# EAGLE design mainboard_transmitter.vf0.1 (EAGLE 7.1.0)
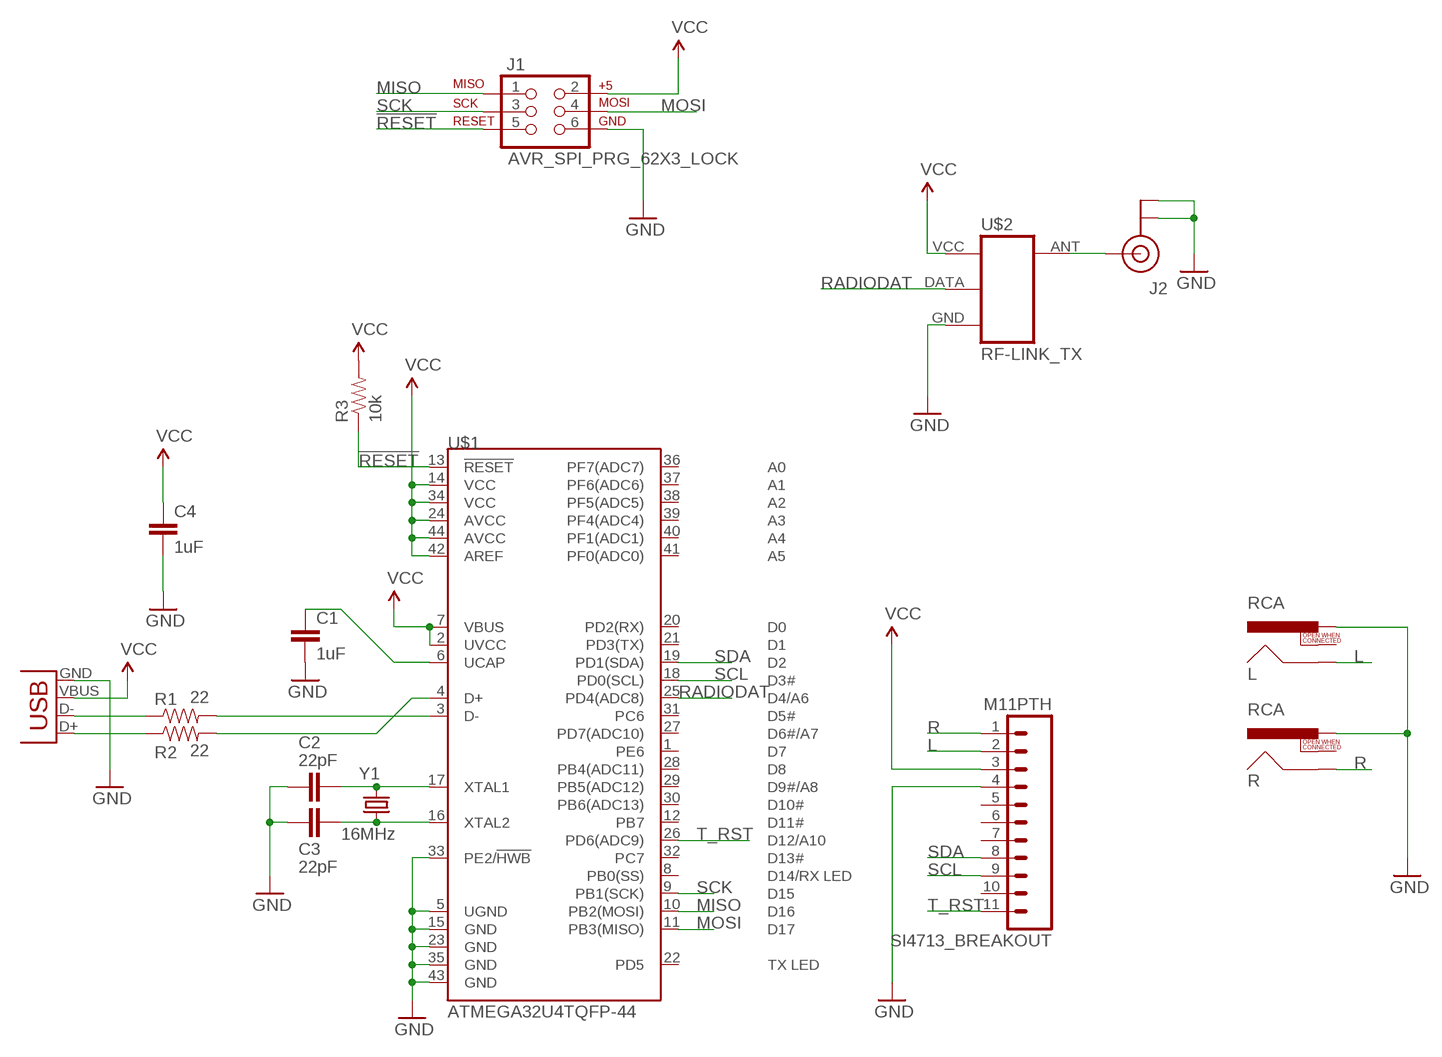
[diagram p0: schematic, sheet 1]

## Parts
C1  1uF  CAPPTH  [CAP-PTH-SMALL]
C2  22pF  CAPPTH  [CAP-PTH-SMALL]
C3  22pF  CAPPTH  [CAP-PTH-SMALL]
C4  1uF  CAPPTH  [CAP-PTH-SMALL]
J1  AVR_SPI_PRG_62X3_LOCK  [2X3_LOCK]
J2  U.FL  [U.FL]
JP1  USB-B  USBPTH  [USB-B-PTH]
L  RCA  [RCA]
R  RCA  [RCA]
R1  22  RESISTORPTH-1/4W-VERT  [AXIAL-0.1]
R2  22  RESISTORPTH-1/4W-VERT  [AXIAL-0.1]
R3  10k  10KOHM-1/4W5%(PTH)VERT  [AXIAL-0.1]
SI4713_BREAKOUT  M11PTH  [1X11]
U$1  ATMEGA32U4TQFP-44  [TQFP44]
U$2  RF-LINK_TX  [RF-LINK_TX]
Y1  16MHz  CRYSTALHC49US  [HC49US]

## Nets
!RESET: J1.5 R3.P$1 U$1.13(!RESET)
GND: C1.2 C2.1 C3.1 C4.2 J1.6 J2.P$1(GND) J2.P$2(GND) JP1.GND L.PIN R.PIN SI4713_BREAKOUT.4 U$1.5(UGND) U$1.15(GND) U$1.23(GND) U$1.33(PE2/!HWB) U$1.35(GND) U$1.43(GND) U$2.GND
L: L.SHELL SI4713_BREAKOUT.2
MISO: J1.1 U$1.10(PB2(MOSI))
MOSI: J1.4 U$1.11(PB3(MISO))
N$1: JP1.D+ R2.P$1
N$2: JP1.D- R1.P$1
N$3: R1.P$2 U$1.3(D-)
N$4: R2.P$2 U$1.4(D+)
N$5: C1.1 U$1.6(UCAP)
N$6: C2.2 U$1.17(XTAL1) Y1.2
N$7: C3.2 U$1.16(XTAL2) Y1.1
N$9: J2.P$3(SIGNAL) U$2.ANT
R: R.SHELL SI4713_BREAKOUT.1
RADIODAT: U$1.25(PD4(ADC8)) U$2.DATA
SCK: J1.3 U$1.9(PB1(SCK))
SCL: SI4713_BREAKOUT.9 U$1.18(PD0(SCL))
SDA: SI4713_BREAKOUT.8 U$1.19(PD1(SDA))
T_RST: SI4713_BREAKOUT.11 U$1.26(PD6(ADC9))
VCC: C4.1 J1.2 JP1.VBUS R3.P$2 SI4713_BREAKOUT.3 U$1.2(UVCC) U$1.7(VBUS) U$1.14(VCC) U$1.24(AVCC) U$1.34(VCC) U$1.42(AREF) U$1.44(AVCC) U$2.VCC(+5V)
Unconnected: L.SWITCH R.SWITCH SI4713_BREAKOUT.5 SI4713_BREAKOUT.6 SI4713_BREAKOUT.7 SI4713_BREAKOUT.10 U$1.1(PE6) U$1.8(PB0(SS)) U$1.12(PB7) U$1.20(PD2(RX)) U$1.21(PD3(TX)) U$1.22(PD5) U$1.27(PD7(ADC10)) U$1.28(PB4(ADC11)) U$1.29(PB5(ADC12)) U$1.30(PB6(ADC13)) U$1.31(PC6) U$1.32(PC7) U$1.36(PF7(ADC7)) U$1.37(PF6(ADC6)) U$1.38(PF5(ADC5)) U$1.39(PF4(ADC4)) U$1.40(PF1(ADC1)) U$1.41(PF0(ADC0))

## Library data of the parts
C1-C4 = SparkFun-Capacitors:CAP: Capacitor Standard 0603 ceramic capacitor, and 0.1" leaded capacitor.
J1 = SparkFun-Connectors:AVR_SPI_PRG_6: AVR ISP 6 Pin This is the reduced ISP connector for AVR programming. Common on Arduino. This footprint will take up less PCB space and can be used with a 10-pin to 6-pin adapter such as SKU: BOB-08508 **Special note about "TEST_POINT" package. The stop mask is on the top side, so if you want your programming test points to be on the bottom of your board, make sure to place this package on the bottom side of the board. This also ensure that the orientation to program from the bottom side will be correct.
J2 = SparkFun-Connectors:U.FL: SMD antenna connector- WRL-09144; PROD_ID: CONN-09193
JP1 = SparkFun-Connectors:USB: USB Connectors USB-B-PTH is fully proven SKU : PRT-00139/CONN-08278 USB-miniB is fully proven SKU : PRT-00587 USB-A-PCB is untested. USB-A-H is throughly reviewed, but untested. Spark Fun Electronics SKU : PRT-00437 USB-B-SMT is throughly reviewed, but untested. Needs silkscreen touching up. USB-A-S has not been used/tested USB-MB-H has not been used/tested USB-MICROB has been used. CONN-09505; PROD_ID: CONN-08278
L R = SparkFun-Connectors:RCA
R1 R2 = SparkFun-Resistors:RESISTOR: Resistor Basic schematic elements and footprints for 0603, 1206, and PTH resistors.
R3 = SparkFun-Resistors:10KOHM-1/4W5%(PTH): RES-09435; PROD_ID: RES-9435
SI4713_BREAKOUT = SparkFun-Connectors:M11: Header 11 Standard 11-pin 0.1" header. Use with straight break away headers (SKU : PRT-00116), right angle break away headers (PRT-00553), swiss pins (PRT-00743), machine pins (PRT-00117), and female headers (PRT-00115).
U$1 = SparkFun-DigitalIC:ATMEGA32U4: Atmel 44-pin 8-bit Microcontroller with 32KBytes of ISP Flash and USB Controller
U$2 = SparkFun-RF:RF-LINK_TX: RF Link transmitters WRL-8945, 8946
Y1 = SparkFun-FreqCtrl:CRYSTAL: Various standard crystals. Proven footprints. Spark Fun Electronics SKU : COM-00534

## Board
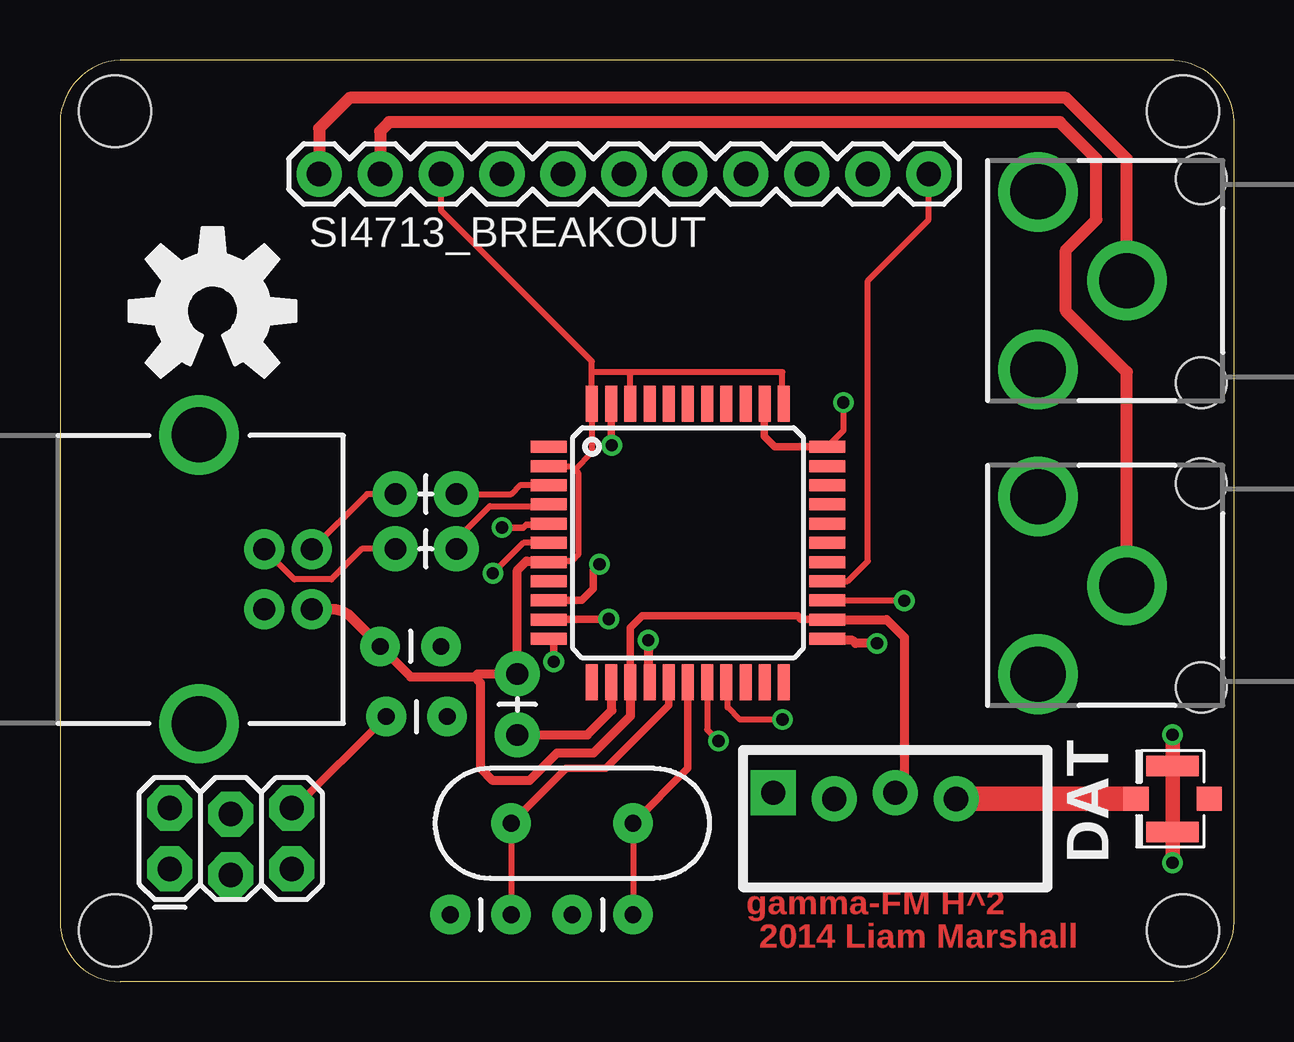
[diagram p1: board, top side]
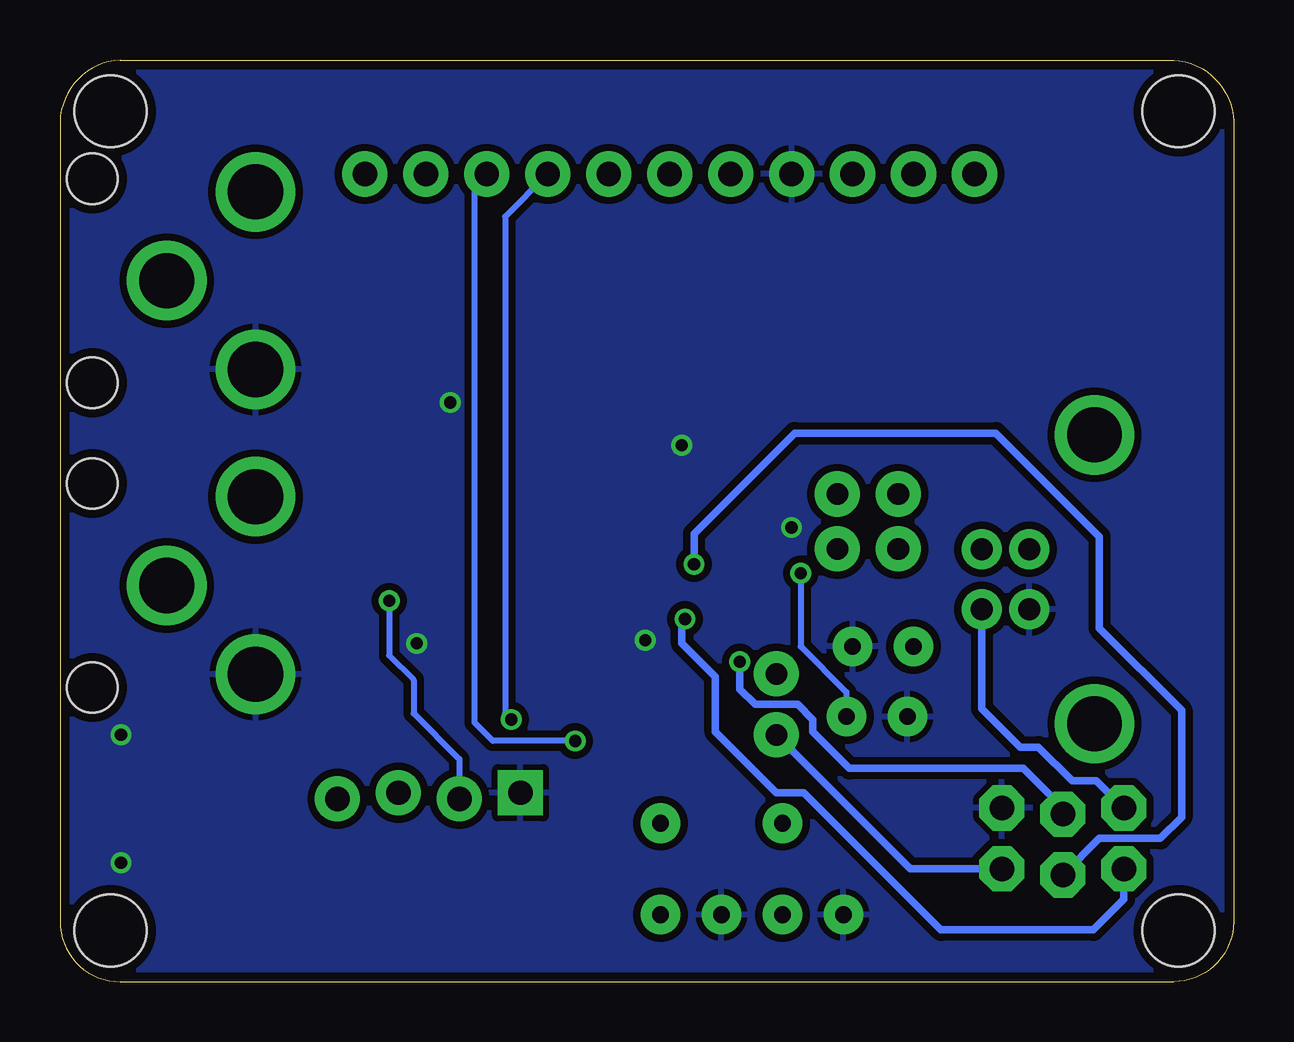
[diagram p2: board, bottom side, seen from below]

Size 48.9 x 38.4 mm. Coordinates in mm from the lower left corner, seen from the top.
Outline: 46.4,38.41 2.5,38.41 arc90 0,35.6 0,2.5 arc90 2.5,0 46.4,0 arc90 48.9,2.5 48.9,35.6 arc90 46.4,38.41
Copper layers (1*16): Top 0.0356mm / dielectric 1.5011mm / Bottom 0.0356mm
Design rules "LaenPCBOrder": minimum track width 6mil, minimum drill 13mil, track to track 6mil, track to pad 6mil, pad to pad 6mil, via to via 6mil, smd to smd 6mil, copper to edge 15mil, drill to drill 6mil, minimum pad ring 7mil, minimum via ring 7mil, stop-mask expansion 3mil, vias tented up to drill 0mil, thermal gap 10mil
Holes 3 mm at 2.29,2.13 46.79,2.13 46.79,36.27 2.29,36.27

### Footprints (pad centres in the part's own frame; a part is rotated, then mirrored left to right if it is on the bottom)
CAP-PTH-SMALL = drill 0.7 pad 1.651: 1 0,0; 2 2.54,0
2X3_LOCK = drill 1.016 pad 1.88 octagon: 1 0,0; 2 0,2.54; 3 2.54,-0.254; 4 2.54,2.286; 5 5.08,0; 6 5.08,2.54
U.FL = smd 2.2 x 0.85: P$1 0,1.375; P$2 0,-1.375 | smd 1.05 x 1: P$3 1.525,0; P$4 -1.525,0
USB-B-PTH = drill 0.914 pad 1.676: D+ 0,1.25; D- 1.981,1.25; GND 0,-1.25; VBUS 1.981,-1.25 | drill 2.286: S1 -2.718,-6.02; S2 -2.718,6.02
RCA = drill 2.3: PIN 3.7,3.7; SHELL 0,0; SWITCH 3.7,-3.7 | hole 2.1: -3.1,4.25; -3.1,-4.25
AXIAL-0.1 = drill 0.9 pad 1.88: P$1 0,0; P$2 2.54,0
1X11 = drill 1.016 pad 1.88: 1 0,0; 2 2.54,0; 3 5.08,0; 4 7.62,0; 5 10.16,0; 6 12.7,0; 7 15.24,0; 8 17.78,0; 9 20.32,0; 10 22.86,0; 11 25.4,0
TQFP44 = smd 1.5 x 0.5: 1 -5.8,4; 2 -5.8,3.2; 3 -5.8,2.4; 4 -5.8,1.6; 5 -5.8,0.8; 6 -5.8,0; 7 -5.8,-0.8; 8 -5.8,-1.6; 9 -5.8,-2.4; 10 -5.8,-3.2; 11 -5.8,-4; 23 5.8,-4; 24 5.8,-3.2; 25 5.8,-2.4; 26 5.8,-1.6; 27 5.8,-0.8; 28 5.8,0; 29 5.8,0.8; 30 5.8,1.6; 31 5.8,2.4; 32 5.8,3.2; 33 5.8,4 | smd 0.5 x 1.5: 12 -4,-5.8; 13 -3.2,-5.8; 14 -2.4,-5.8; 15 -1.6,-5.8; 16 -0.8,-5.8; 17 0,-5.8; 18 0.8,-5.8; 19 1.6,-5.8; 20 2.4,-5.8; 21 3.2,-5.8; 22 4,-5.8; 34 4,5.8; 35 3.2,5.8; 36 2.4,5.8; 37 1.6,5.8; 38 0.8,5.8; 39 0,5.8; 40 -0.8,5.8; 41 -1.6,5.8; 42 -2.4,5.8; 43 -3.2,5.8; 44 -4,5.8
RF-LINK_TX = drill 1.016 pad 1.88: ANT 7.62,-0.127; DATA 2.54,-0.127; VCC 5.08,0.127 | drill 1.016 pad 1.88 square: GND 0,0.127
HC49US = drill 0.7 pad 1.651: 1 -2.54,0; 2 2.54,0

### Placement (x,y rotation side)
C1  16.13,11.05 180 top
C2  21.34,2.79 0 top
C3  16.26,2.79 0 top
C4  13.34,13.97 0 top
J1  4.57,4.7 0 top
J2  46.36,7.62 180 top
JP1  8.51,16.76 0 top
L  44.45,16.51 180 top
R  44.45,29.21 180 top
R1  13.97,20.32 0 top
R2  13.97,18.03 0 top
R3  19.05,10.29 90 top
SI4713_BREAKOUT  10.8,33.66 0 top
U$1  26.16,18.29 0 top
U$2  29.72,7.75 0 top
U$3  [OSHW-LOGO-L]  6.35,27.94 0 top
Y1  21.34,6.6 0 top

### Tracks (layer width: path | path; a pad name or v marks a point on that pad's centre or on a via)
!RESET
  Top 0.381: R3.P$1 21.97,10.29 22.99,11.3 22.99,12.46 U$1.13
  Bottom 0.305: J1.5 13.46,4.7 R3.P$1
GND  (via drill 0.51)
  Top 0.254: v32.64,24.13 32.64,22.96 U$1.33
  Top 0.279: v18.42,18.92 19.31,18.92 19.43,19.05 20.4,19.05
  Top 0.305: J1.6 9.78,7.24 C1.2 | U$1.43 22.96,22.38 v22.99,22.35 | U$1.33 29.78,22.29 29.34,22.73 29.34,24.06 U$1.35
  Top 0.381: v34.04,14.1 33.15,14.1 33.02,14.22 32.03,14.22 U$1.23 | v24.51,14.22 24.51,12.54 U$1.15 | 20.4,19.05 U$1.5
  Top 0.61: v46.36,4.95 J2.P$1 J2.P$2 v46.36,10.29
  pour Bottom (isolate 0.305): 58.42,-2.54 -7.62,-2.54 -7.62,40.64 58.42,40.64
L
  Top 0.508: L.SHELL 44.45,25.4 41.91,27.94 41.91,30.48 43.18,31.75 43.18,34.29 41.66,35.81 13.72,35.81 13.34,35.43 SI4713_BREAKOUT.2
MISO  (via drill 0.51)
  Top 0.305: v22.86,15.11 20.39,15.11 U$1.10
  Bottom 0.305: J1.1 4.57,3.43 5.84,2.16 12.19,2.16 17.91,7.87 19.05,7.87 21.59,10.41 21.59,12.7 22.99,14.1 22.99,14.99 v22.86,15.11
MOSI  (via drill 0.51)
  Top 0.305: v20.58,13.34 20.58,14.08 U$1.11
  Bottom 0.305: J1.4 7.11,7.24 8.77,8.89 16,8.89 17.53,10.41 17.53,10.92 18.16,11.56 19.94,11.56 20.58,12.19 v20.58,13.34
N$1
  Top 0.254: R2.P$1 12.58,18.03 11.31,16.76 9.76,16.76 JP1.D+
N$2
  Top 0.254: R1.P$1 12.8,20.32 JP1.D-
N$3
  Top 0.254: R1.P$2 18.8,20.32 19.18,20.7 20.35,20.7 U$1.3
N$4
  Top 0.254: R2.P$2 16.51,18.41 17.91,19.81 20.29,19.81 U$1.4
N$5  (via drill 0.51)
  Top 0.254: U$1.6 19.31,18.29 v18.04,17.02
  Bottom 0.254: v18.04,17.02 18.04,13.97 16.13,12.06 C1.1
N$6
  Top 0.254: Y1.2 C2.2
  Top 0.305: U$1.17 26.16,8.89 Y1.2
N$7
  Top 0.254: Y1.1 C3.2
  Top 0.305: U$1.16 25.36,11.52 22.74,8.89 21.08,8.89 Y1.1
N$9
  Top 1.016: J2.P$3 U$2.ANT
R
  Top 0.508: R.SHELL 44.45,34.29 41.91,36.83 12.07,36.83 10.8,35.56 SI4713_BREAKOUT.1
RADIODAT  (via drill 0.51)
  Top 0.254: U$1.25 35.17,15.89 v35.18,15.88
  Bottom 0.254: v35.18,15.88 35.18,13.59 34.17,12.57 34.17,11.18 32.26,9.27 U$2.DATA
SCK  (via drill 0.51)
  Top 0.305: U$1.9 21.73,15.89 22.23,16.38 22.23,17.14 v22.48,17.4
  Bottom 0.305: v22.48,17.4 22.48,18.67 18.29,22.86 9.91,22.86 5.59,18.54 5.59,14.73 2.16,11.3 2.16,6.86 3.05,5.97 5.59,5.97 J1.3
SCL  (via drill 0.51)
  Top 0.254: U$1.18 26.96,10.5 v27.43,10.03
  Bottom 0.254: v27.43,10.03 30.86,10.03 31.63,10.79 31.63,33.15 SI4713_BREAKOUT.9
SDA  (via drill 0.51)
  Top 0.254: v30.1,10.92 28.32,10.92 27.82,11.43 27.82,12.44 U$1.19
  Bottom 0.254: SI4713_BREAKOUT.8 30.36,31.88 30.36,11.18 v30.1,10.92
T_RST
  Top 0.254: U$1.26 32.82,16.69 33.66,17.53 33.66,29.21 36.2,31.75 SI4713_BREAKOUT.11
VCC
  Top 0.254: U$1.2 21.31,21.49 21.47,21.34 | 21.47,21.34 21.59,21.21 21.59,17.78 21.34,17.53 20.4,17.53 U$1.7 | 21.47,21.34 22.16,22.04 U$1.44 22.16,25.4 | 22.16,25.4 22.16,25.84 15.88,32.13 SI4713_BREAKOUT.3 | U$1.42 23.76,25.4 | 23.76,25.4 22.16,25.4 | U$1.34 30.1,24.09 30.1,25.4 23.76,25.4
  Top 0.305: U$1.14 23.76,14.74 24.26,15.24 30.74,15.24 30.86,15.11 31.94,15.11 U$1.24
  Top 0.381: C4.1 14.61,12.7 17.27,12.7 | 17.27,12.7 17.4,12.83 R3.P$2 19.05,17.14 19.43,17.53 20.33,17.53 U$1.7 | U$1.14 23.76,11.06 22.23,9.53 20.7,9.53 19.56,8.38 18.04,8.38 17.53,8.89 17.53,12.45 17.27,12.7 | U$1.24 34.44,15.09 35.18,14.35 35.18,8.26 U$2.VCC
  Top 0.432: JP1.VBUS 11.38,15.51 arc-45 12.09,15.22 C4.1
  Bottom 0.305: JP1.VBUS 10.49,11.38 8.89,9.78 8.13,9.78 6.73,8.38 5.72,8.38 J1.2

### Text on the board
Top: gamma-FM H^2 | 2014 Liam Marshall
tPlace: DAT
tStop: gamma-FM H^2 | vf0.1 | 2014 Liam Marshall
bStop: vf0.1